# EAGLE design 1giriş3çıkışparalel (EAGLE 9.6.2)
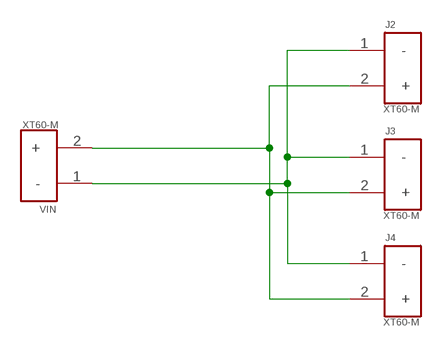
[diagram p0: schematic, sheet 1]

## Parts
J2  XT60-M  [AMASS_XT60-M]
J3  XT60-M  [AMASS_XT60-M]
J4  XT60-M  [AMASS_XT60-M]
VIN  XT60-M  [AMASS_XT60-M]

## Nets
N$1: J2.1(-) J3.1(-) J4.1(-) VIN.1(-)
N$2: J2.2(+) J3.2(+) J4.2(+) VIN.2(+)

## Library data of the parts
J2-J4 VIN = XT60-M:XT60-M: DC supply; XT60; male; PIN:2; for cable; soldered; 60A; 500V; AVAILABILITY: Unavailable; DESCRIPTION: Plug; DC supply; XT60; male; PIN: 2; for cable; soldered; 30A; 500V; MF: AMASS; MP: XT60-M; PACKAGE: Package; PRICE: None

## Board
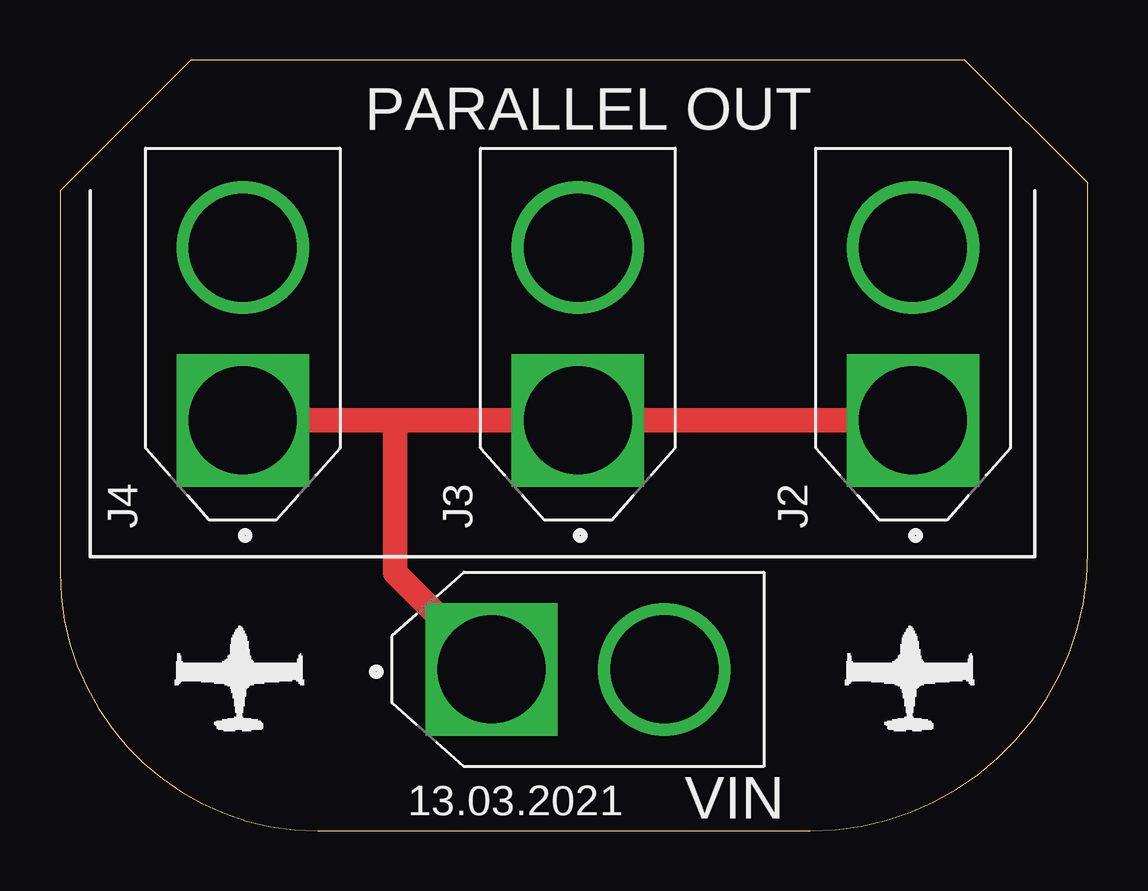
[diagram p1: board, top side]
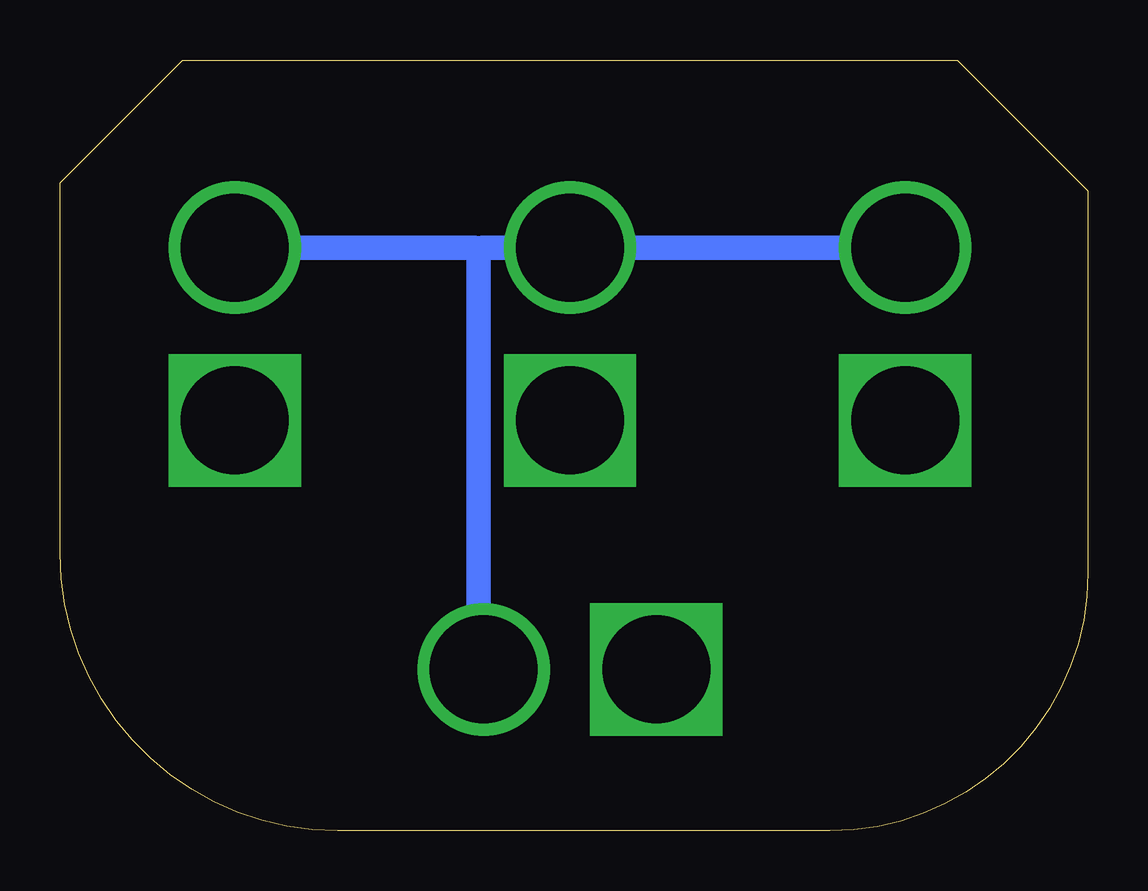
[diagram p2: board, bottom side, seen from below]

Size 42.85 x 32.12 mm. Coordinates in mm from the lower left corner, seen from the top.
Outline: 0,26.67 0,10.75 arc90 10.75,0 31.27,0 arc90 42.85,11.58 42.85,27 37.73,32.12 5.45,32.12 0,26.67
Copper layers (1*16): Top 0.035mm / dielectric 1.5mm / Bottom 0.035mm
Design rules "default": minimum track width 6mil, minimum drill 0.35mm, track to track 6mil, track to pad 6mil, pad to pad 6mil, via to via 6mil, smd to smd 6mil, copper to edge 40mil, drill to drill 6mil, minimum pad ring 10mil, minimum via ring 8mil, stop-mask expansion 4mil, vias tented up to drill 0mil, thermal gap 10mil

### Footprints (pad centres in the part's own frame; a part is rotated, then mirrored left to right if it is on the bottom)
AMASS_XT60-M = drill 4.5 square: 1 -3.6,0 | drill 4.5: 2 3.6,0

### Placement (x,y rotation side)
J2  35.56,20.7 90 top
J3  21.59,20.7 90 top
J4  7.62,20.7 90 top
VIN  21.59,6.73 0 top

### Tracks (layer width: path | path; a pad name or v marks a point on that pad's centre or on a via)
N$1
  Top 1.016: VIN.1 13.97,10.75 13.97,17.1 | 13.97,17.1 J4.1 | 13.97,17.1 J3.1 J2.1
N$2
  Bottom 0.762: VIN.2 25.4,6.94 | 25.57,24.3 25.4,24.13 25.23,24.3
  Bottom 1.016: 25.4,6.94 25.4,24.13 | 25.57,24.3 J2.2 | 25.23,24.3 J3.2 J4.2

### Text on the board
tNames: PARALLEL OUT | 13.03.2021 | VIN